# EAGLE design PWM5 Controller (EAGLE 7.6.0)
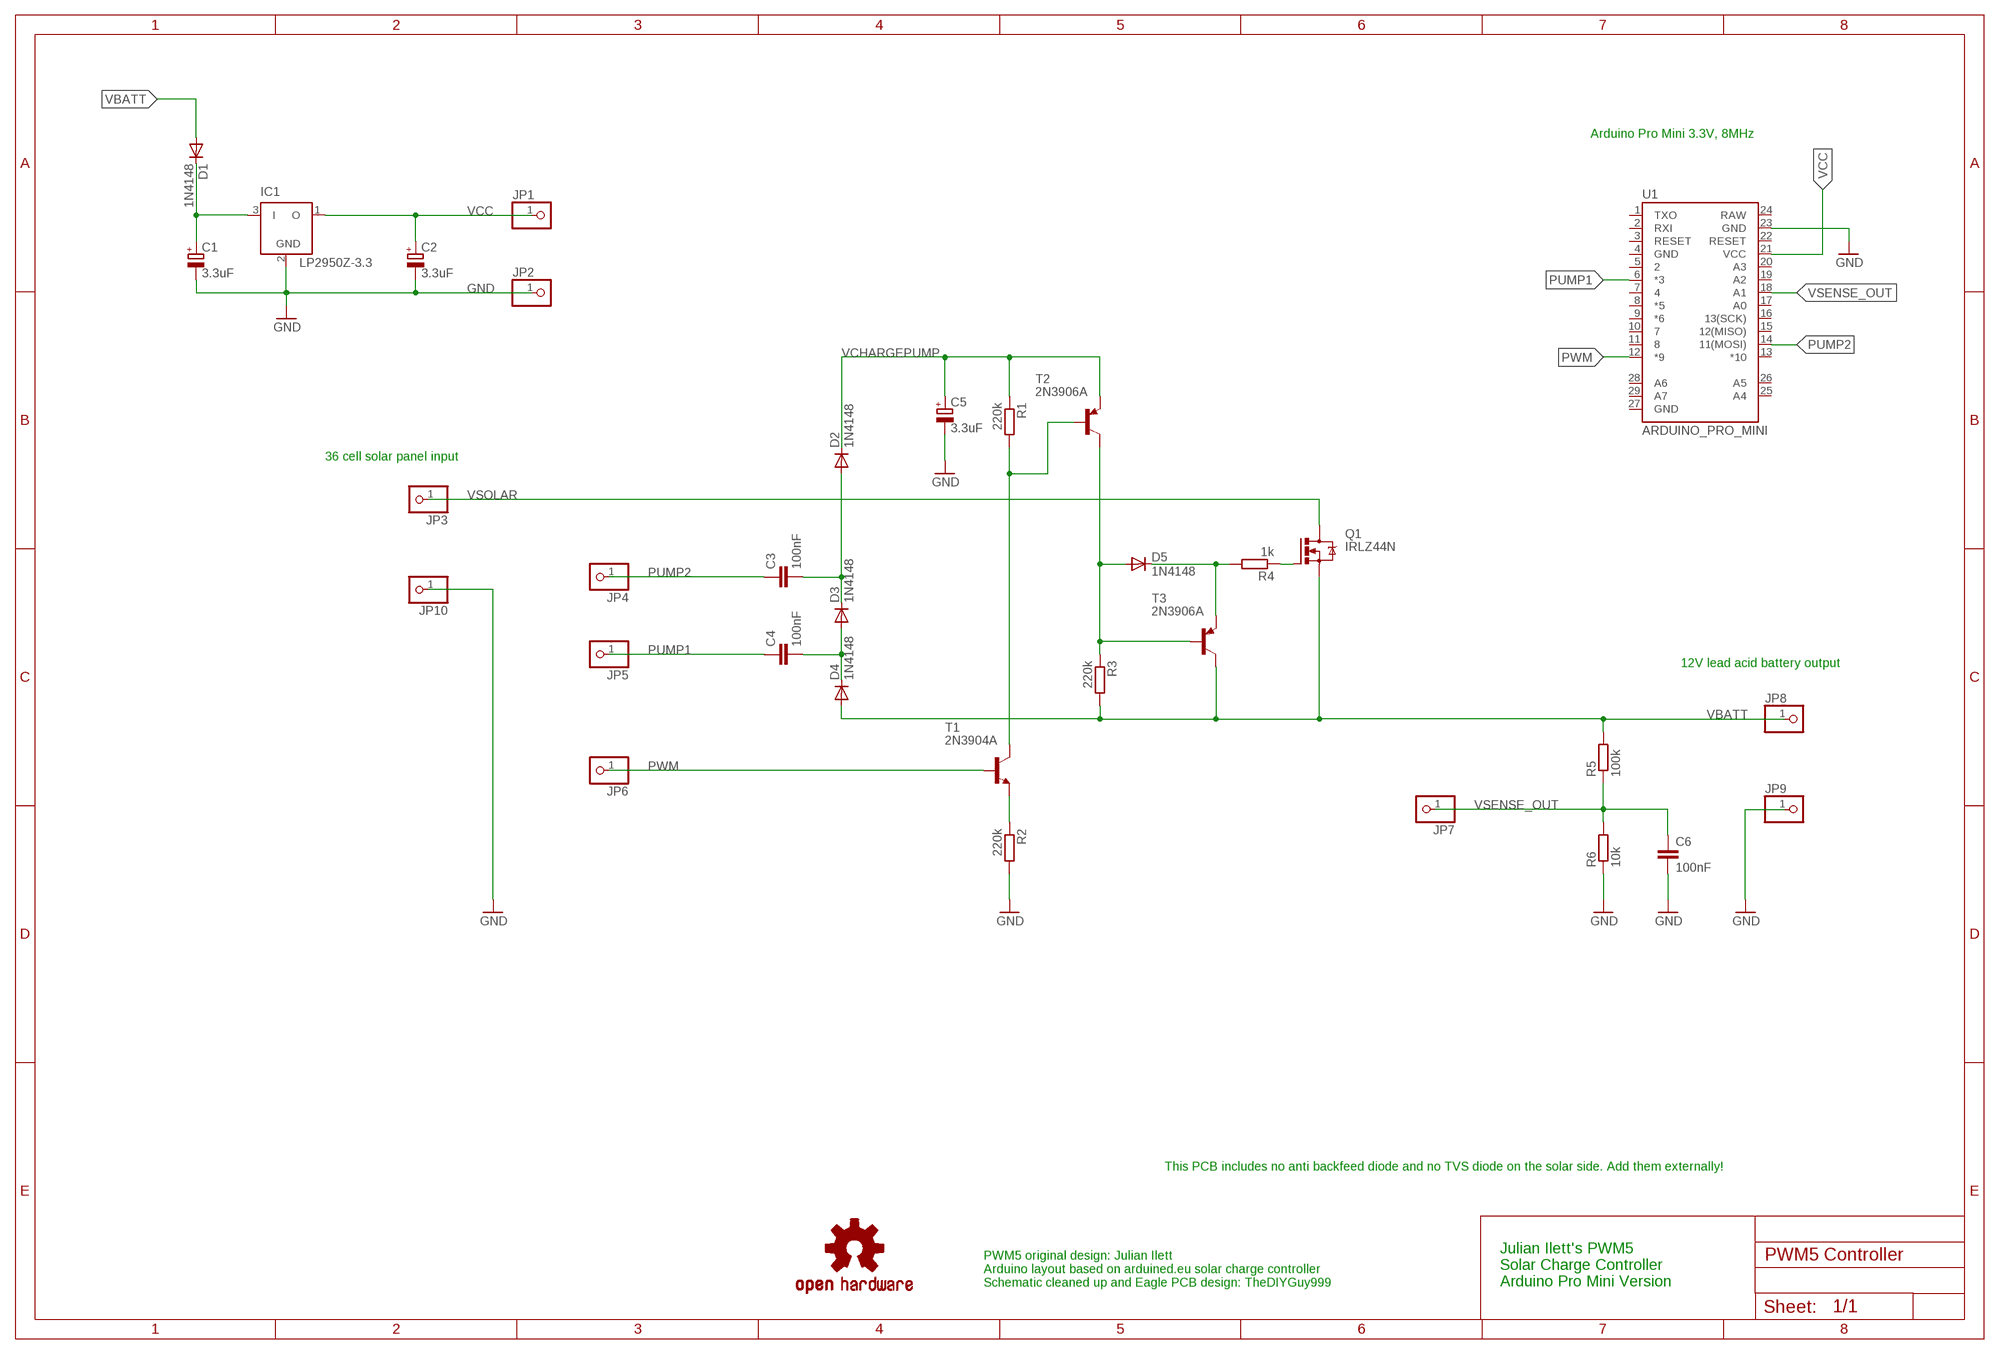
[diagram p0: schematic, sheet 1]

## Parts
C1  3.3uF  CPOL-EUB45181A  [B45181A]
C2  3.3uF  CPOL-EUB45181A  [B45181A]
C3  100nF  C-EU050-024X044  [C050-024X044]
C4  100nF  C-EU050-024X044  [C050-024X044]
C5  3.3uF  CPOL-EUB45181A  [B45181A]
C6  100nF  C-EU025-024X044  [C025-024X044]
D1  1N4148  1N4148DO35-V  [DO35-V]
D2  1N4148  [DO35-V2]
D3  1N4148  [DO35-V2]
D4  1N4148  1N4148DO35-V  [DO35-V]
D5  1N4148  1N4148DO35-V  [DO35-V]
IC1  LP2950Z-3.3  LP2950Z-AMMOPACK  [TO92-AMMOPACK]
JP1  PINHD-1X1  [1X01]
JP2  PINHD-1X1  [1X01]
JP3  PINHD-1X1  [1X01]
JP4  PINHD-1X1  [1X01]
JP5  PINHD-1X1  [1X01]
JP6  PINHD-1X1  [1X01]
JP7  PINHD-1X1  [1X01]
JP8  PINHD-1X1  [1X01]
JP9  PINHD-1X1  [1X01]
JP10  PINHD-1X1  [1X01]
LOGO1  OSHW-LOGOS  [OSHW-LOGO-S]
Q1  IRLZ44N  STP5NA50  [TO220BV]
R1  220k  R-EU_0207/2V  [0207/2V]
R2  220k  R-EU_0207/2V  [0207/2V]
R3  220k  R-EU_0207/2V  [0207/2V]
R4  1k  R-EU_0207/2V  [0207/2V]
R5  100k  R-EU_0207/5V  [0207/5V]
R6  10k  R-EU_0207/5V  [0207/5V]
T1  2N3904A  [TO92-AMMOPACK]
T2  2N3906A  [TO92-AMMOPACK]
T3  2N3906A  [TO92-AMMOPACK]
U1  ARDUINO_PRO_MINI  [ARDUINO_PRO_MINI]

## Nets
GND: C1.- C2.- C5.- C6.2 IC1.2(GND) JP2.1 JP9.1 JP10.1 R2.2 R6.1 U1.23(GND)
N$1: D5.C R4.2 T3.3(E)
N$2: Q1.G R4.1
N$3: C1.+ D1.C IC1.3(I)
N$4: R2.1 T1.3(E)
N$5: D5.A R3.1 T2.1(C) T3.2(B)
N$7: R1.2 T1.1(C) T2.2(B)
N$8: C4.2 D3.A D4.C
N$9: C3.2 D2.A D3.C
PUMP1: C4.1 JP5.1 U1.6(*3)
PUMP2: C3.1 JP4.1 U1.14(11(MOSI))
PWM: JP6.1 T1.2(B) U1.12(*9)
VBATT: D1.A D4.A JP8.1 Q1.S R3.2 R5.2 T3.1(C)
VCC: C2.+ IC1.1(O) JP1.1 U1.21(VCC)
VCHARGEPUMP: C5.+ D2.C R1.1 T2.3(E)
VSENSE_OUT: C6.1 JP7.1 R5.1 R6.2 U1.18(A1)
VSOLAR: JP3.1 Q1.D
Unconnected: U1.1(TXO) U1.2(RXI) U1.3(RESET) U1.4(GND) U1.5 U1.7 U1.8(*5) U1.9(*6) U1.10 U1.11 U1.13(*10) U1.15(12(MISO)) U1.16(13(SCK)) U1.17(A0) U1.19(A2) U1.20(A3) U1.22(RESET) U1.24(RAW) U1.25(A4) U1.26(A5) U1.27(GND) U1.28(A6) U1.29(A7)

## Notes on the sheet
- Arduino Pro Mini 3.3V, 8MHz
- 36 cell solar panel input
- 12V lead acid battery output
- This PCB includes no anti backfeed diode and no TVS diode on the solar side. Add them externally!
- PWM5 original design: Julian Ilett
  Arduino layout based on arduined.eu solar charge controller
  Schematic cleaned up and Eagle PCB design: TheDIYGuy999
- Julian Ilett's PWM5
  Solar Charge Controller
  Arduino Pro Mini Version

## Library data of the parts
C1 C2 C5 = rcl:CPOL-EU: POLARIZED CAPACITOR, European symbol
C3 C4 C6 = rcl:C-EU: CAPACITOR, European symbol
D1-D5 = 00_custom:1N4148: DIODE high speed (Philips)
IC1 = 00_linear:LP2950: 100 mA, Low Power Low Dropout Voltage Regulator Source: http://www.onsemi.com/pub/Collateral/LP2950-D.PDF
JP1-JP10 = pinhead:PINHD-1X1: PIN HEADER
LOGO1 = SparkFun-Aesthetics:OSHW-LOGO: Open Source Hardware Logo This logo indicates the piece of hardware it is found on incorporates a OSHW license and/or adheres to the definition of open source hardware found here: http://freedomdefined.org/OSHW
Q1 = 00_transistor-power:STP5NA50: N-CHANNEL MOS FET
R1-R6 = rcl:R-EU_: RESISTOR, European symbol
T1 = 00_custom:2N3904: NPN Transistor
T2 T3 = 00_custom:2N3906: PNP Transistor
U1 = 00_custom:ARDUINO_PRO_MINI

## Board
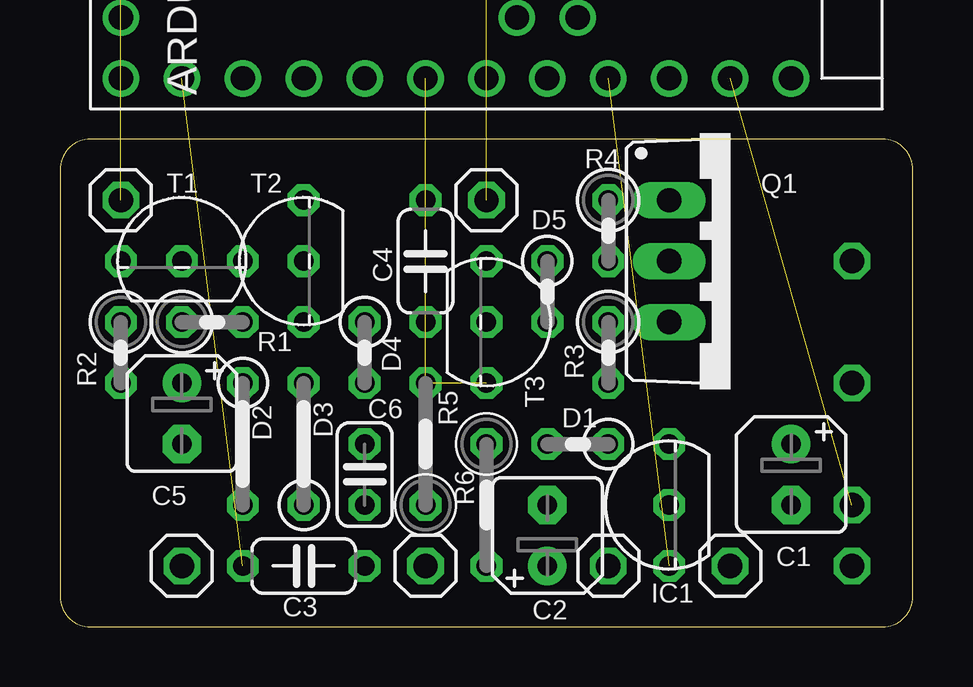
[diagram p1: board, top side]
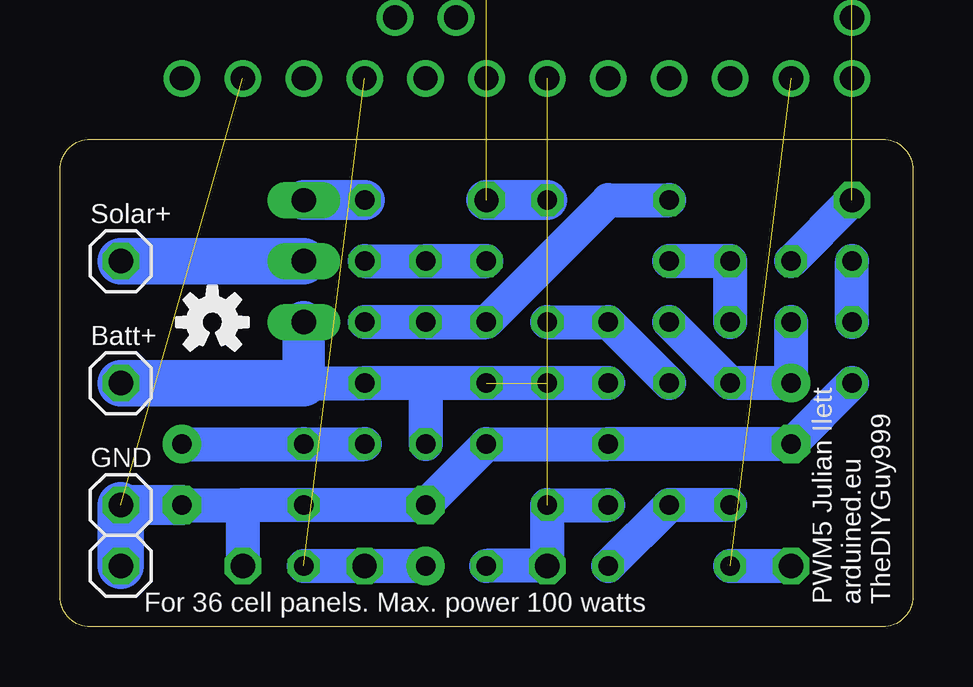
[diagram p2: board, bottom side, seen from below]

Size 35.56 x 20.32 mm. Coordinates in mm from the lower left corner, seen from the top.
Outline: 1.27,0 34.29,0 arc90 35.56,1.27 35.56,19.05 arc90 34.29,20.32 1.27,20.32 arc90 0,19.05 0,1.27 arc90 1.27,0
Copper layers (1*16): Top 0.035mm / dielectric 1.5mm / Bottom 0.035mm
Design rules "default": minimum track width 10mil, minimum drill 24mil, track to track 8mil, track to pad 8mil, pad to pad 8mil, via to via 8mil, smd to smd 8mil, copper to edge 40mil, drill to drill 8mil, minimum pad ring 10mil, minimum via ring 8mil, stop-mask expansion 4mil, vias tented up to drill 0mil, thermal gap 10mil

### Footprints (pad centres in the part's own frame; a part is rotated, then mirrored left to right if it is on the bottom)
B45181A = drill 0.813 pad 1.6: + -1.27,0 | drill 0.813 pad 1.6 octagon: - 1.27,0
C050-024X044 = drill 0.813 octagon: 1 -2.54,0; 2 2.54,0
C025-024X044 = drill 0.813 octagon: 1 -1.27,0; 2 1.27,0
DO35-V = drill 0.813 octagon: A 2.54,0; C 0,0
DO35-V2 = drill 0.813 octagon: A 3.81,0; C -1.27,0
TO92-AMMOPACK = drill 0.813 octagon: 1 -2.54,0; 2 0,0; 3 2.54,0
1X01 = drill 1.016 octagon: 1 0,0
TO220BV = drill 1.016 long: D 0,-2.54; G -2.54,-2.54; S 2.54,-2.54
0207/2V = drill 0.813 octagon: 1 -1.27,0; 2 1.27,0
0207/5V = drill 0.813 octagon: 1 -2.54,0; 2 2.54,0
TO92-AMMOPACK' = drill 0.813 octagon: 1 2.54,0; 2 0,0; 3 -2.54,0
ARDUINO_PRO_MINI = drill 1.016 square: 1 -7.62,12.7 | drill 1.016: 2 -7.62,10.16; 3 -7.62,7.62; 4 -7.62,5.08; 5 -7.62,2.54; 6 -7.62,0; 7 -7.62,-2.54; 8 -7.62,-5.08; 9 -7.62,-7.62; 10 -7.62,-10.16; 11 -7.62,-12.7; 12 -7.62,-15.24; 13 7.62,-15.24; 14 7.62,-12.7; 15 7.62,-10.16; 16 7.62,-7.62; 17 7.62,-5.08; 18 7.62,-2.54; 19 7.62,0; 20 7.62,2.54; 21 7.62,5.08; 22 7.62,7.62; 23 7.62,10.16; 24 7.62,12.7; 25 5.08,1.27; 26 5.08,3.81; 27 0,-15.24; 28 2.54,-15.24; 29 5.08,-15.24

### Placement (x,y rotation side)
C1  30.48,6.35 270 top
C2  20.32,3.81 90 top
C3  10.16,2.54 0 top
C4  15.24,15.24 270 top
C5  5.08,8.89 270 top
C6  12.7,6.35 90 top
D1  22.86,7.62 180 top
D2  7.62,8.89 270 top
D3  10.16,6.35 90 top
D4  12.7,12.7 270 top
D5  20.32,15.24 270 top
IC1  25.4,5.08 90 top
JP1  22.86,2.54 0 top
JP2  27.94,2.54 0 top
JP3  33.02,15.24 0 bottom
JP4  5.08,2.54 0 top
JP5  17.78,17.78 0 top
JP6  2.54,17.78 0 top
JP7  15.24,2.54 0 top
JP8  33.02,10.16 0 bottom
JP9  33.02,2.54 0 bottom
JP10  33.02,5.08 0 bottom
LOGO1  29.21,12.7 0 bottom
Q1  27.94,15.24 270 top
R1  6.35,12.7 0 top
R2  2.54,11.43 270 top
R3  22.86,11.43 270 top
R4  22.86,16.51 270 top
R5  15.24,7.62 90 top
R6  17.78,5.08 270 top
T1  2N3904A  [TO92-AMMOPACK']  5.08,15.24 0 top
T2  2N3906A  [TO92-AMMOPACK']  10.16,15.24 90 top
T3  2N3906A  [TO92-AMMOPACK']  17.78,12.7 270 top
U1  17.78,30.48 270 top

### Tracks (layer width: path | path; a pad name or v marks a point on that pad's centre or on a via)
GND  (1 unrouted)
  Bottom 1.422: R2.2 C5.- C6.2 R6.1 C2.- IC1.2 27.94,5.08 | C1.- 27.94,5.08 | 27.94,5.08 JP2.1
  Bottom 1.676: C1.- JP10.1
  Bottom 1.93: JP10.1 JP9.1
N$1
  Bottom 1.422: R4.2 T3.3 D5.C
N$2
  Bottom 1.676: R4.1 Q1.G
N$3
  Bottom 1.422: C1.+ IC1.3 D1.C
N$4
  Bottom 1.422: R2.1 T1.3
N$5
  Bottom 1.422: D5.A T3.2 | T3.2 R3.1 | T3.2 12.7,17.78 T2.1
N$7
  Bottom 1.422: R1.2 T1.1 T2.2
N$8
  Bottom 1.422: C4.2 D4.C D3.A
N$9
  Bottom 1.422: D2.A D3.C C3.2
PUMP1  (1 unrouted)
  Bottom 1.676: C4.1 JP5.1
PUMP2  (1 unrouted)
  Bottom 1.422: C3.1 JP4.1
PWM  (1 unrouted)
  Bottom 1.422: T1.2 JP6.1
VBATT  (1 unrouted)
  Bottom 1.422: D4.A T3.1 20.32,10.16 | 20.32,10.16 R3.2 25.4,10.16 | 20.32,10.16 D1.A
  Bottom 1.778: 25.4,10.16 Q1.S
  Bottom 1.93: JP8.1 25.4,10.16
VCC  (1 unrouted)
  Bottom 1.422: IC1.1 JP1.1 C2.+
VCHARGEPUMP
  Bottom 1.422: R1.1 C5.+ D2.C T2.3
VSENSE_OUT  (1 unrouted)
  Bottom 1.422: R6.2 JP7.1 R5.1 C6.1
VSOLAR
  Bottom 1.93: Q1.D JP3.1

### Text on the board
bNames: Solar+ | Batt+ | GND | PWM5 Julian Ilett / arduined.eu / TheDIYGuy999 | For 36 cell panels. Max. power 100 watts